# EAGLE schematic MUL (EAGLE 9.6.2)
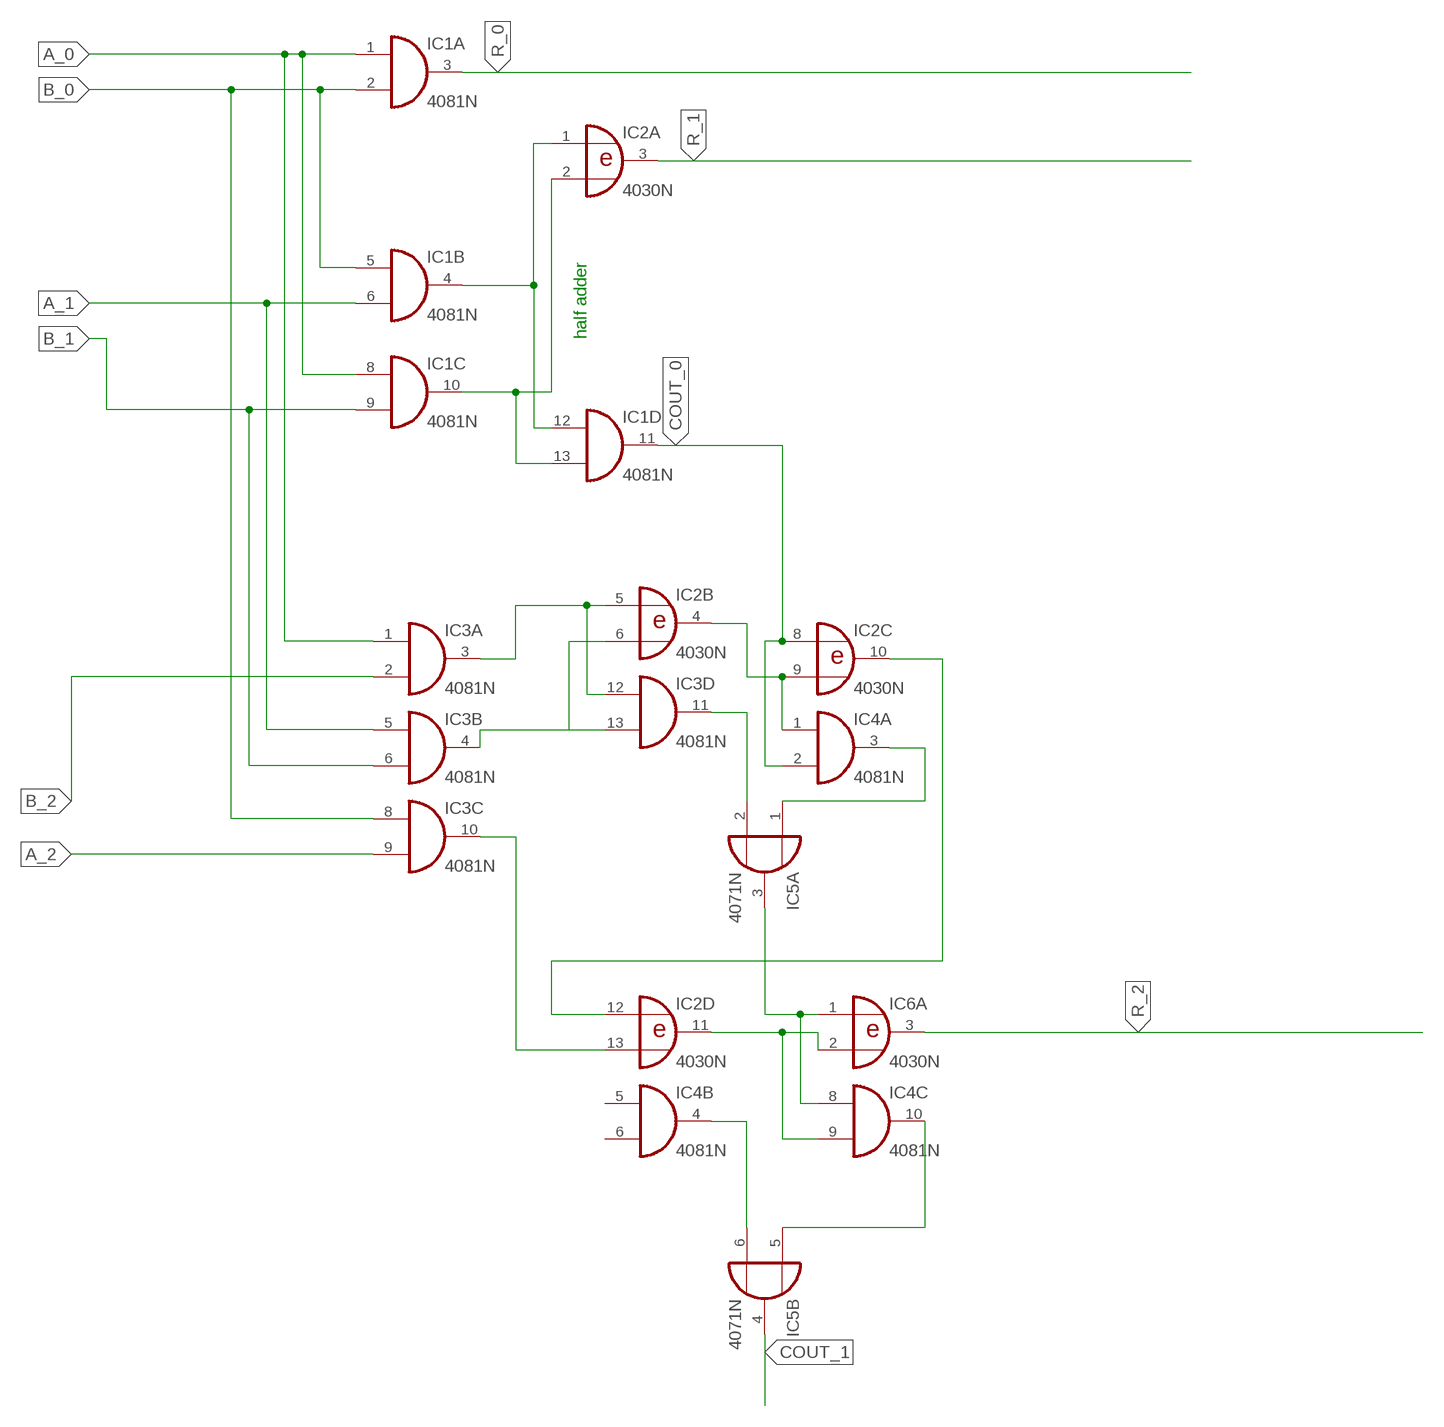
[diagram p0: schematic, sheet 1]

## Parts
IC1  4081N  [DIL14]
IC2  4030N  [DIL14]
IC3  4081N  [DIL14]
IC4  4081N  [DIL14]
IC5  4071N  [DIL14]
IC6  4030N  [DIL14]

## Nets
A_0: IC1.1(A:I0) IC1.8(C:I0) IC3.1(A:I0)
A_1: IC1.6(B:I1) IC3.5(B:I0)
A_2: IC3.9(C:I1)
B_0: IC1.2(A:I1) IC1.5(B:I0) IC3.8(C:I0)
B_1: IC1.9(C:I1) IC3.6(B:I1)
B_2: IC3.2(A:I1)
COUT_0: IC1.11(D:O) IC2.8(C:I0) IC4.2(A:I1)
COUT_1: IC5.4(B:O)
N$1: IC1.4(B:O) IC1.12(D:I0) IC2.1(A:I0)
N$2: IC1.10(C:O) IC1.13(D:I1) IC2.2(A:I1)
N$3: IC2.4(B:O) IC2.9(C:I1) IC4.1(A:I0)
N$4: IC2.5(B:I0) IC3.3(A:O) IC3.12(D:I0)
N$5: IC2.6(B:I1) IC3.4(B:O) IC3.13(D:I1)
N$6: IC3.11(D:O) IC5.2(A:I1)
N$7: IC4.3(A:O) IC5.1(A:I0)
N$8: IC2.13(D:I1) IC3.10(C:O)
N$9: IC2.11(D:O) IC4.9(C:I1) IC6.2(A:I1)
N$10: IC2.10(C:O) IC2.12(D:I0)
N$11: IC4.8(C:I0) IC5.3(A:O) IC6.1(A:I0)
N$12: IC4.4(B:O) IC5.6(B:I1)
N$13: IC4.10(C:O) IC5.5(B:I0)
R_0: IC1.3(A:O)
R_1: IC2.3(A:O)
R_2: IC6.3(A:O)
Unconnected: IC4.5(B:I0) IC4.6(B:I1) IC4.11(D:O) IC4.12(D:I0) IC4.13(D:I1) IC5.8(C:I0) IC5.9(C:I1) IC5.10(C:O) IC5.11(D:O) IC5.12(D:I0) IC5.13(D:I1) IC6.4(B:O) IC6.5(B:I0) IC6.6(B:I1) IC6.8(C:I0) IC6.9(C:I1) IC6.10(C:O) IC6.11(D:O) IC6.12(D:I0) IC6.13(D:I1)

## Notes on the sheet
- half adder

## Power pins joined to a net without a drawn wire
VDD: IC1.14(P:VDD) IC2.14(P:VDD) IC3.14(P:VDD) IC4.14(P:VDD) IC5.14(P:VDD) IC6.14(P:VDD)
VSS: IC1.7(P:VSS) IC2.7(P:VSS) IC3.7(P:VSS) IC4.7(P:VSS) IC5.7(P:VSS) IC6.7(P:VSS)

## Library data of the parts
IC1 IC3 IC4 = 40xx:4081: Quad 2-input AND
IC2 IC6 = 40xx:4030: Quad XOR
IC5 = 40xx:4071: Quad 2-input OR